# EAGLE design node_sound (EAGLE 6.6.0)
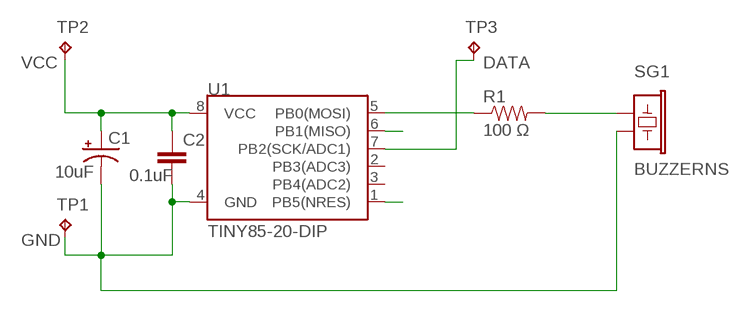
[diagram p0: schematic, sheet 1]

## Parts
C1  10uF  10UF-16V-10%(TANT)  [EIA3216]
C2  0.1uF  CAP1206  [1206]
R1  100 Ω  RESISTOR1206  [1206]
SG1  BUZZERNS  [BUZZER-12MM-NS]
TP1  PADSTP13R  [CIRCLE-PAD-1/4]
TP2  PADSTP13R  [CIRCLE-PAD-1/4]
TP3  PADSTP13R  [CIRCLE-PAD-1/4]
U1  TINY85-20-DIP  ATTINY45TINY45-20-DIP  [DIP08]

## Nets
GND: C1.C(-) C2.2 SG1.- TP1.TP U1.4(GND)
MISO-6: U1.6(PB1(MISO))
MOSI-5: R1.1 U1.5(PB0(MOSI))
N$1: R1.2 SG1.+
RST: U1.1(PB5(NRES))
SCK-7: TP3.TP U1.7(PB2(SCK/ADC1))
VCC: C1.A(+) C2.1 TP2.TP U1.8(VCC)
Unconnected: U1.2(PB3(ADC3)) U1.3(PB4(ADC2))

## Library data of the parts
C1 = SparkFun-Capacitors:10UF-16V-10%(TANT): CAP-00811 1206/EIA-3216 Tantalum capacitor; PROD_ID: CAP-00811
C2 = SparkFun-Capacitors:CAP: Capacitor Standard 0603 ceramic capacitor, and 0.1" leaded capacitor.
R1 = SparkFun-Passives:RESISTOR: Resistor Basic schematic elements and footprints for 0603, 1206, and PTH resistors.
SG1 = SparkFun-Electromechanical:BUZZER: Buzzer 12mm Spark Fun Electronics SKU : Comp-Buzzer
TP1 = swamy-library:PADS: Pads; TP_SIGNAL_NAME: GND
TP2 = swamy-library:PADS: Pads; TP_SIGNAL_NAME: VCC
TP3 = swamy-library:PADS: Pads; TP_SIGNAL_NAME: DATA
U1 = SparkFun-DigitalIC:ATTINY45: Atmel 8-pin 2/4/8kB flash uC; PROD_ID: IC-09439; VALUE: TINY45-20-DIP

## Board
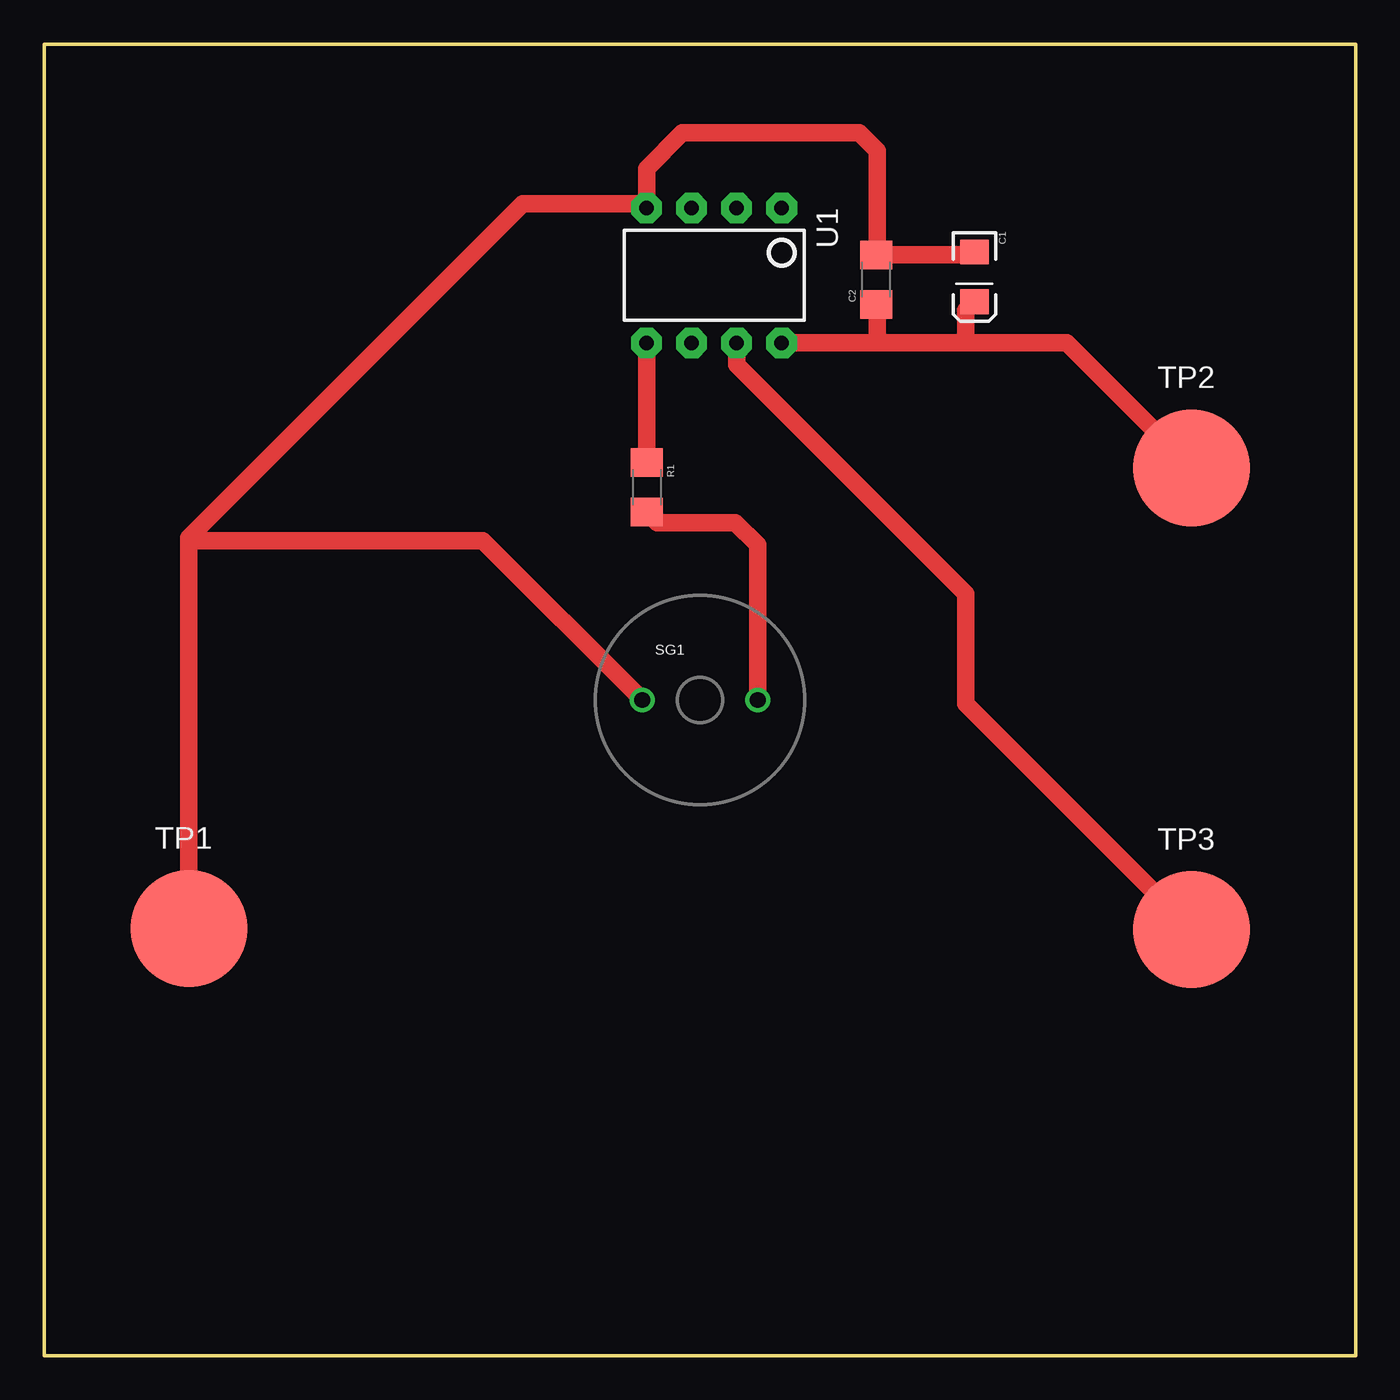
[diagram p1: board, top side]

Size 74 x 74 mm. Coordinates in mm from the lower left corner, seen from the top.
Outline: 74,74 74,0 0,0 0,74 74,74
Copper layers (1*16): Top 0.035mm / dielectric 1.5mm / Bottom 0.035mm
Design rules "default": minimum track width 10mil, minimum drill 24mil, track to track 8mil, track to pad 8mil, pad to pad 8mil, via to via 8mil, smd to smd 8mil, copper to edge 40mil, drill to drill 8mil, minimum pad ring 10mil, minimum via ring 8mil, stop-mask expansion 4mil, vias tented up to drill 0mil, thermal gap 10mil

### Footprints (pad centres in the part's own frame; a part is rotated, then mirrored left to right if it is on the bottom)
EIA3216 = smd 1.4 x 1.6: A 1.4,0; C -1.4,0
1206 = smd 1.6 x 1.8: 1 -1.4,0; 2 1.4,0
BUZZER-12MM-NS = drill 0.9: + 3.25,0; - -3.25,0
CIRCLE-PAD-1/4 = smd 6.604 x 6.604: TP 0,0
DIP08 = drill 0.813 pad 1.727 octagon: 1 -3.81,-3.81; 2 -1.27,-3.81; 3 1.27,-3.81; 4 3.81,-3.81; 5 3.81,3.81; 6 1.27,3.81; 7 -1.27,3.81; 8 -3.81,3.81

### Placement (x,y rotation side)
C1  52.48,60.88 270 top
C2  46.94,60.72 90 top
R1  34,49 270 top
SG1  37,37 0 top
TP1  8.16,24.1 0 top
TP2  64.74,50.1 0 top
TP3  64.74,24.04 0 top
U1  37.8,60.96 180 top

### Tracks (layer width: path | path; a pad name or v marks a point on that pad's centre or on a via)
GND
  Top 1: C1.C 52.32,62.12 C2.2 47,62.18 47,68 46,69 36,69 33.99,66.99 U1.4 33.76,65 27,65 8.16,46.16 8.16,46 | TP1.TP 8.16,46 | SG1.- 24.75,46 8.16,46
MOSI-5
  Top 1: U1.5 R1.1
N$1
  Top 1: SG1.+ 40.25,45.75 39,47 34.6,47 R1.2
SCK-7
  Top 1: U1.7 39.07,55.93 52,43 52,36.78 TP3.TP
VCC
  Top 1: TP2.TP 57.69,57.15 52,57.15 | 52,57.15 47,57.15 | 47,57.15 U1.8 | C2.1 47,59.26 47,57.15 | C1.A 52,59 52,57.15

### Text on the board
tLabels: VCC | GND | ♫ | DATA | ♫ | ♫ | Sound Module